# Altium schematic sheet ph_sensor_board.SchDoc
size A4
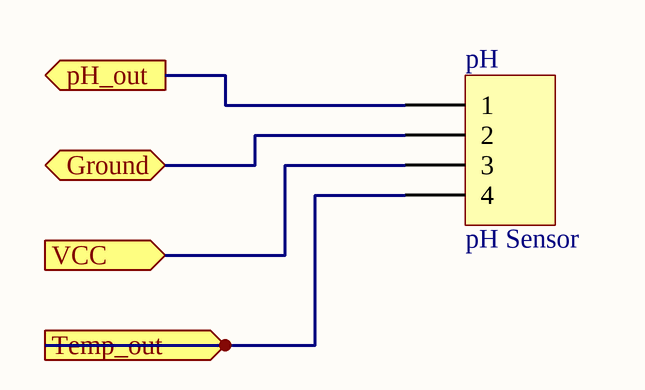
[diagram p0: ph_sensor_board.SchDoc]

## Parts
pH  pH Sensor  [4_channel_terminal_block]

## Ports
Ground (bidir), pH_out (out), Temp_out (out), VCC (in)

## Nets
Ground: pH.2 ; port Ground
pH_out: pH.1 ; port pH_out
Temp_out: pH.4 ; port Temp_out
VCC: pH.3 ; port VCC

## Library data of the parts
pH = Header 4: Header, 4-Pin; LatestRevisionDate: 17-Jul-2002; LatestRevisionNote: Re-released for DXP Platform.; Publisher: Altium Limited